# Altium schematic sheet 3v3_LDO.SchDoc
size A; SheetNumber: 6; SheetTotal: 8
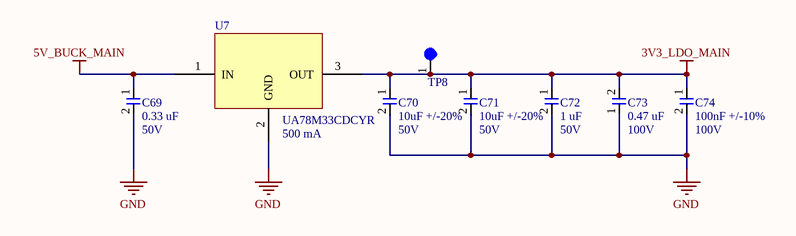
[diagram p0: 3v3_LDO.SchDoc]

## Parts
C69  Capacitance: 0.33 uF  Voltage: 50V  [CAP-0603]  (hidden comment: CGA3E3X7R1H334K080AB)
C70  Capacitance: 10uF +/-20%  Voltage Rating: 50V  [CAP-1206]  (hidden comment: CL31B106KBHNNNE)
C71  Capacitance: 10uF +/-20%  Voltage Rating: 50V  [CAP-1206]  (hidden comment: CL31B106KBHNNNE)
C72  Capacitance: 1 uF  Voltage: 50V  [CAP-0603]  (hidden comment: UMK107AB7105KA-T)
C73  Capacitance: 0.47 uF  Voltage: 100V  [CAP-0805]  (hidden comment: KAM21KR72A474KL)
C74  Capacitance: 100nF +/-10%  Voltage Rating: 100V  [CAP-0603]  (hidden comment: CC0603KRX7R0BB104)
TP8  5003  [TEST-POINT-0001]  (value not drawn)
U7  UA78M33CDCYR  Current: 500 mA  [IC-SOT-223-4]

## Nets
3V3_LDO_MAIN: C70.1 C71.1 C72.1 C73.2 C74.1 TP8.1 U7.3(OUT)
5V_BUCK_MAIN: C69.1 U7.1(IN)
GND: C69.2 C70.2 C71.2 C72.2 C73.1 C74.2 U7.2(GND)

## Library data of the parts
C69 = CAP-0.33uF-0001: 0.33 µF ±10% 50V Ceramic Capacitor X7R 0603 (1608 Metric); Manufacturer: TDK Corporation; Tolerance: +/- 10%; Manufacturer Part Number: CGA3E3X7R1H334K080AB; Temperature Coefficient: X7R
C70 C71 = CAP-10U-0001: 10 µF ±10% 50V Ceramic Capacitor X7R 1206 (3216 Metric); Manufacturer: Samsung Electro-Mechanics; Assembled?: no; Manufacturer Part Number: CL31B106KBHNNNE; Temperature Coefficient: X7R; Package Size: 1206
C72 = CAP-1U-0002: 1 µF ±10% 50V Ceramic Capacitor X7R 0603 (1608 Metric); Package Size: 0603
C73 = CAP-0.47U-0001: 0.47 µF ±10% 100V Ceramic Capacitor X7R 0805 (2012 Metric); Tolerance: +/- 10%; Assembled?: No; Temperature Coefficient: X7R; Package Size: 0805
C74 = CAP-100N-0001: CAP CER 0.1UF 100V X7R 0603; Manufacturer: YAGEO; Assembled?: no; Manufacturer Part Number: CC0603KRX7R0BB104; Temperature Coefficient: X7R; Package Size: 0603
TP8 = TEST-POINT-0001: Oranange PC Test Point, Miniature Phoisphor Bronze Silver Plating Through Hole Mounting Type
U7 = IC-LDO-3.3V-0002: Linear Voltage Regulator IC Positive Fixed 1 Output 500mA SOT-223-4; Vin: 25V; Vout: 3.3V; Package: SOT-223-4